# EAGLE design Prototype 0.2 (EAGLE 9.7.0)
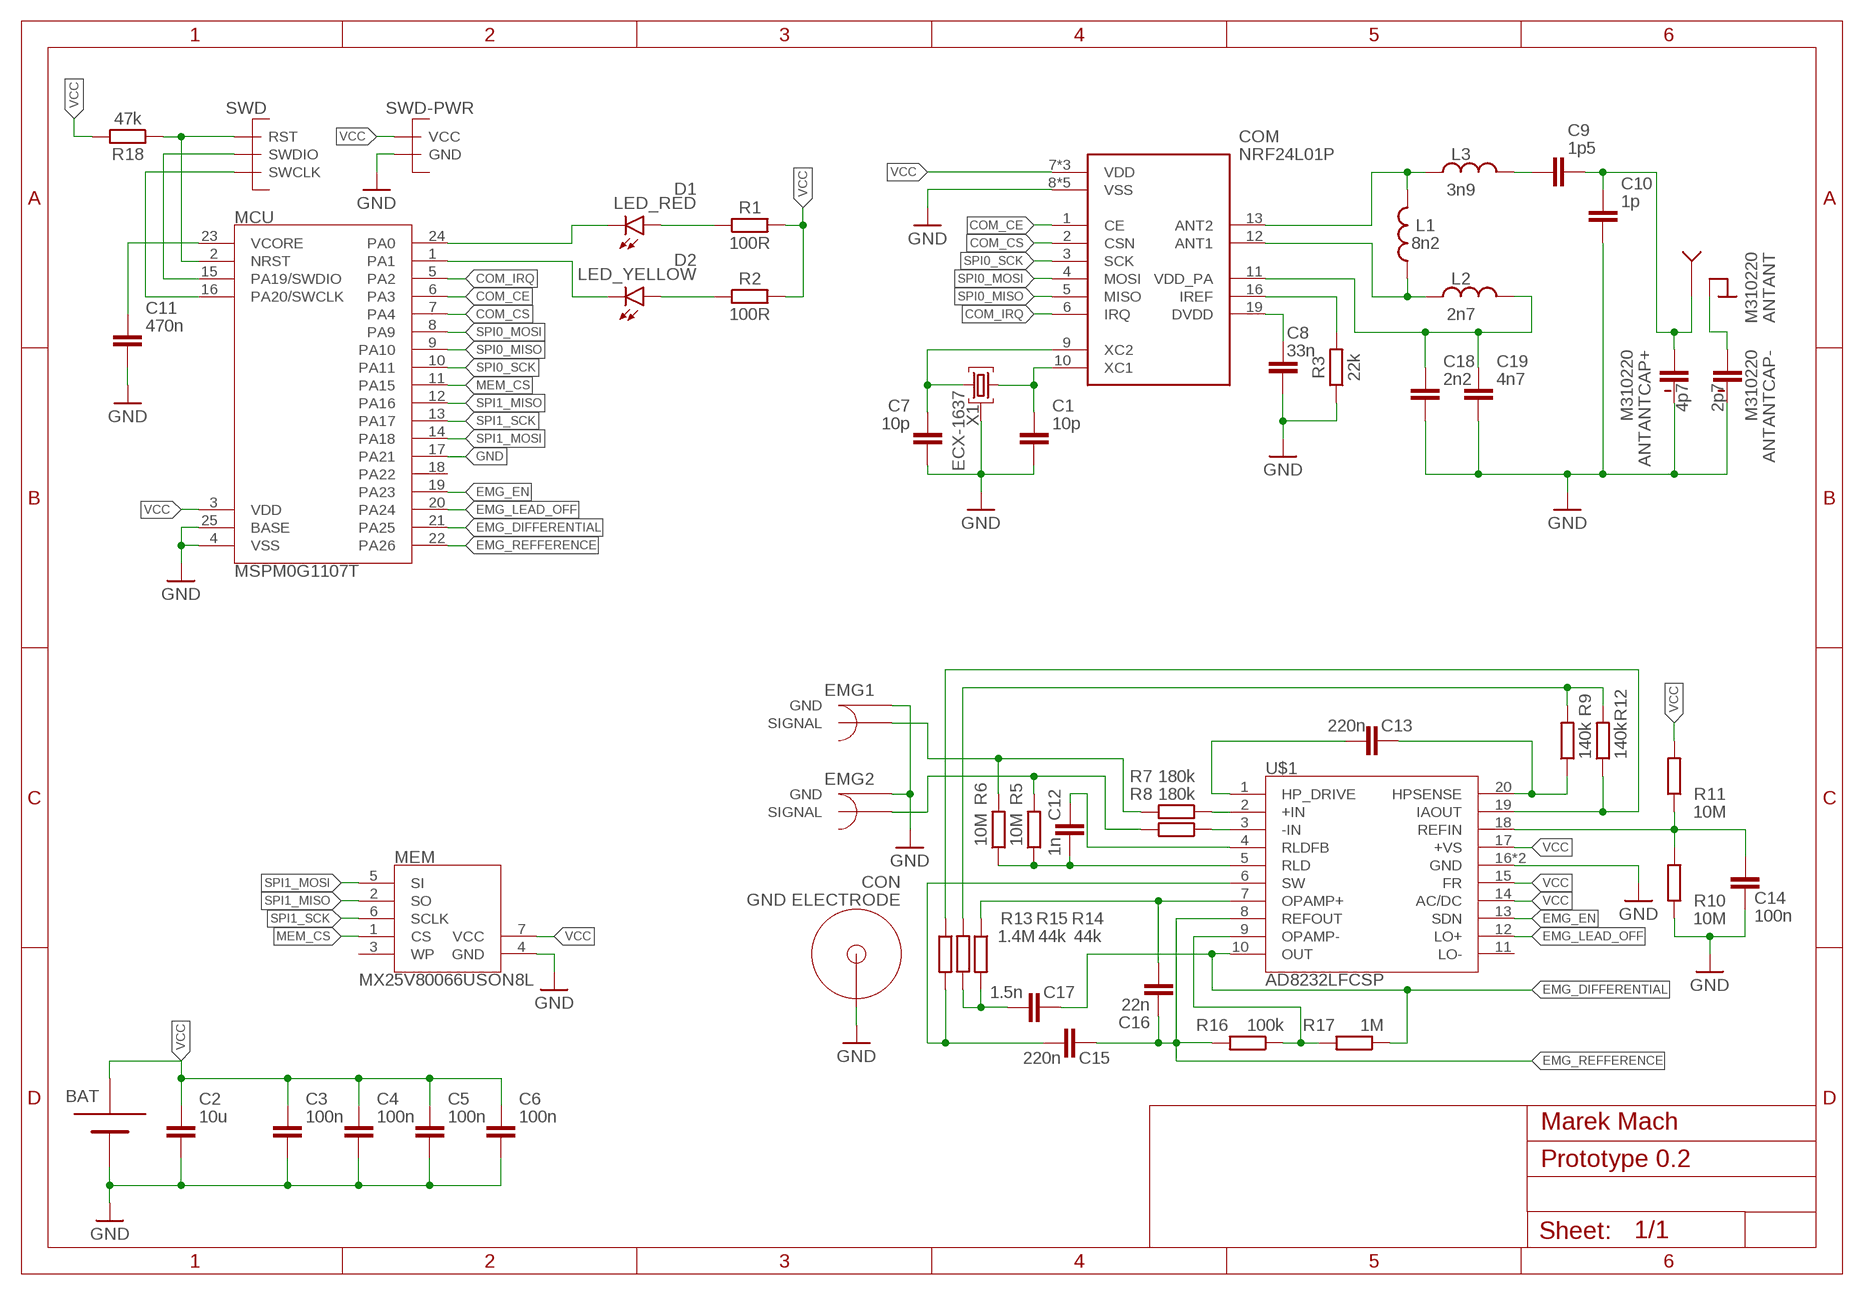
[diagram p0: schematic, sheet 1]

## Parts
ANT  M310220  [M310220]
BAT  2025BAT-HLD-005-THM  [BAT-HLD-005-THM]
C1  10p  C_CHIP-0402(1005-METRIC)  [CAPC1005X60]
C2  10u  C_CHIP-0603(1608-METRIC)  [CAPC1608X85]
C3  100n  C_CHIP-0603(1608-METRIC)  [CAPC1608X85]
C4  100n  C_CHIP-0603(1608-METRIC)  [CAPC1608X85]
C5  100n  C_CHIP-0603(1608-METRIC)  [CAPC1608X85]
C6  100n  C_CHIP-0603(1608-METRIC)  [CAPC1608X85]
C7  10p  C_CHIP-0402(1005-METRIC)  [CAPC1005X60]
C8  33n  C_CHIP-0402(1005-METRIC)  [CAPC1005X60]
C9  1p5  C_CHIP-0402(1005-METRIC)  [CAPC1005X60]
C10  1p  C_CHIP-0402(1005-METRIC)  [CAPC1005X60]
C11  470n  C_CHIP-0603(1608-METRIC)  [CAPC1608X85]
C12  1n  C_CHIP-0603(1608-METRIC)  [CAPC1608X85]
C13  220n  C_CHIP-0603(1608-METRIC)  [CAPC1608X85]
C14  100n  C_CHIP-0603(1608-METRIC)  [CAPC1608X85]
C15  220n  C_CHIP-0603(1608-METRIC)  [CAPC1608X85]
C16  22n  C_CHIP-0603(1608-METRIC)  [CAPC1608X85]
C17  1.5n  C_CHIP-0603(1608-METRIC)  [CAPC1608X85]
C18  2n2  C_CHIP-0402(1005-METRIC)  [CAPC1005X60]
C19  4n7  C_CHIP-0402(1005-METRIC)  [CAPC1005X60]
COM  NRF24L01P  NRF24L01PQFN20  [QFN50P400X400X100-21T265]
CON  GND ELECTRODE  ECG_ELECTRODE_CONNECTOR  [ELECTRODE_CONNECTOR]
D1  LED_RED  CHIP-FLAT-R_0402  [LEDC1005X25N_FLAT-R]
D2  LED_YELLOW  CHIP-FLAT-Y_0402  [LEDC1005X25N_FLAT-Y]
EMG1  SHIELDED-CONNECTOR  [SHIELDED-SMD]
EMG2  SHIELDED-CONNECTOR  [SHIELDED-SMD]
L1  8n2  L_CHIP-0402(1006-METRIC)  [INDC1006X60N]
L2  2n7  L_CHIP-0402(1006-METRIC)  [INDC1006X60N]
L3  3n9  L_CHIP-0402(1006-METRIC)  [INDC1006X60N]
MCU  MSPM0G1107T  MSPM0G1107VQFN24-ROUNDPADS  [QFN50P400X400X100-25T240]
MEM  MX25V80066USON8L  [SON50P300X200X50-8]
R1  100R  R_CHIP-0603(1608-METRIC)  [RESC1608X60]
R2  100R  R_CHIP-0603(1608-METRIC)  [RESC1608X60]
R3  22k  R_CHIP-0402(1005-METRIC)  [RESC1005X40]
R5  10M  R_CHIP-0603(1608-METRIC)  [RESC1608X60]
R6  10M  R_CHIP-0603(1608-METRIC)  [RESC1608X60]
R7  180k  R_CHIP-0603(1608-METRIC)  [RESC1608X60]
R8  180k  R_CHIP-0603(1608-METRIC)  [RESC1608X60]
R9  140k  R_CHIP-0603(1608-METRIC)  [RESC1608X60]
R10  10M  R_CHIP-0603(1608-METRIC)  [RESC1608X60]
R11  10M  R_CHIP-0603(1608-METRIC)  [RESC1608X60]
R12  140k  R_CHIP-0603(1608-METRIC)  [RESC1608X60]
R13  1.4M  R_CHIP-0603(1608-METRIC)  [RESC1608X60]
R14  44k  R_CHIP-0603(1608-METRIC)  [RESC1608X60]
R15  44k  R_CHIP-0603(1608-METRIC)  [RESC1608X60]
R16  100k  R_CHIP-0603(1608-METRIC)  [RESC1608X60]
R17  1M  R_CHIP-0603(1608-METRIC)  [RESC1608X60]
R18  47k  R_CHIP-0603(1608-METRIC)  [RESC1608X60]
SWD  SWD  [3X]
SWD-PWR  PWR  [2X]
U$1  AD8232LFCSP  [QFN50P400X400X80-21T275]
X1  ECX-1637  [WE-XTAL_IQXC-42]

## Nets
COM_CE: COM.1(CE) MCU.6(PA3)
COM_CS: COM.2(CSN) MCU.7(PA4)
COM_IRQ: COM.6(IRQ) MCU.5(PA2)
EMG_DIFFERENTIAL [Analog]: C17.2 MCU.21(PA25) R17.1 U$1.10(OUT)
EMG_EN [Data]: MCU.19(PA23) U$1.13(SDN)
EMG_LEAD_OFF [Data]: MCU.20(PA24) U$1.12(LO+)
EMG_REFFERENCE [Analog]: C15.2 C16.1 MCU.22(PA26) R16.2 U$1.8(REFOUT)
GND: ANT.FEEDCAP-GND(ANTCAP+:NEG) ANT.GNDCAP-GND(ANTCAP-:NEG) BAT.P$1(-) C1.2 C2.2 C3.2 C4.2 C5.2 C6.2 C7.2 C8.2 C10.2 C11.2 C14.1 C18.2 C19.2 COM.8(VSS) COM.14(VSS) COM.17(VSS) COM.20(VSS) COM.21(VSS) CON.P$1 CON.P$2 CON.P$3 CON.P$4 EMG1.GND1(GND) EMG1.GND2(GND) EMG2.GND1(GND) EMG2.GND2(GND) MCU.4(VSS) MCU.17(PA21) MCU.25(BASE) MEM.4(GND) R3.1 R10.1 SWD-PWR.1(GND) U$1.16(GND) U$1.21(GND) X1.2(GND) X1.4(GND)
MEM_CS [Data]: MCU.11(PA15) MEM.1(CS)
N$1: C1.1 COM.10(XC1) X1.1
N$2 [VCC]: C11.1 MCU.23(VCORE)
N$3: D1.A R1.1
N$4: D2.A R2.1
N$5: C7.1 COM.9(XC2) X1.3
N$6: ANT.GNDCAP-GROUND(ANTCAP-:POS) ANT.GROUND
N$7: C8.1 COM.19(DVDD)
N$8: COM.13(ANT2) L1.2 L3.1
N$9: C9.1 L3.2
N$10 [Analog]: EMG1.SIG(SIGNAL) R6.2 R7.2
N$11 [Analog]: EMG2.SIG(SIGNAL) R5.2 R8.2
N$12 [Analog]: R7.1 U$1.2(+IN)
N$13 [Analog]: R8.1 U$1.3(-IN)
N$14 [Analog]: C16.2 R14.1 U$1.7(OPAMP+)
N$16 [Analog]: R16.1 R17.2 U$1.9(OPAMP-)
N$17 [Analog]: R9.2 R12.2 R15.2
N$18 [Analog]: C12.1 R5.1 R6.1 U$1.5(RLD)
N$19 [Analog]: C13.1 U$1.1(HP_DRIVE)
N$20 [Analog]: C13.2 R9.1 U$1.20(HPSENSE)
N$21: COM.16(IREF) R3.2
N$22 [Analog]: C14.2 R10.2 R11.1 U$1.18(REFIN)
N$23: COM.12(ANT1) L1.1 L2.1
N$24 [Analog]: C15.1 R13.2 U$1.6(SW)
N$25: C17.1 R14.2 R15.1
N$26 [Analog]: R12.1 R13.1 U$1.19(IAOUT)
N$27 [Analog]: C12.2 U$1.4(RLDFB)
N$28: ANT.FEED(ANT:ANTENNA) ANT.FEEDCAP-ANT(ANTCAP+:POS) C9.2 C10.1
N$29: C18.1 C19.1 COM.11(VDD_PA) L2.2
RED-STATUS-LED [Data]: D1.C MCU.24(PA0)
RST [Data]: MCU.2(NRST) R18.1 SWD.1(RST)
SPI0_MISO: COM.5(MISO) MCU.9(PA10)
SPI0_MOSI: COM.4(MOSI) MCU.8(PA9)
SPI0_SCK: COM.3(SCK) MCU.10(PA11)
SPI1_MISO [Data]: MCU.12(PA16) MEM.2(SO)
SPI1_MOSI [Data]: MCU.14(PA18) MEM.5(SI)
SPI1_SCK [Data]: MCU.13(PA17) MEM.6(SCLK)
SWCLK [Data]: MCU.16(PA20/SWCLK) SWD.3(SWCLK)
SWDIO [Data]: MCU.15(PA19/SWDIO) SWD.2(SWDIO)
VCC [VCC]: BAT.P$2(+) BAT.P$3(+) C2.1 C3.1 C4.1 C5.1 C6.1 COM.7(VDD) COM.15(VDD) COM.18(VDD) MCU.3(VDD) MEM.7(VCC) R1.2 R2.2 R11.2 R18.2 SWD-PWR.2(VCC) U$1.14(AC/DC) U$1.15(FR) U$1.17(+VS)
YELLOW-STATUS-LED [Data]: D2.C MCU.1(PA1)
Unconnected: MCU.18(PA22) MEM.3(WP) U$1.11(LO-)

## Notes on the sheet
- 4p7 | 2p7
- Marek Mach

## Library data of the parts
ANT = Antenna:M310220
BAT = batery holder:2025: Coin Cell Battery Holders THM COIN CELL CLIP FOR (2) 2032 Source: Datasheet <https://www.keyelco.com/product-pdf.cfm?p=740>
C1 C7-C10 C18 C19 = Capacitor:C: Capacitor - Generic; CATEGORY: Capacitor; PACKAGE_SIZE: 0402; PACKAGE_TYPE: SMD; SUBCATEGORY: Ceramic Capacitors; TYPE: MLCC
C2-C6 C11-C17 = Capacitor:C: Capacitor - Generic; CATEGORY: Capacitor; PACKAGE_SIZE: 0603; PACKAGE_TYPE: SMD; SUBCATEGORY: Ceramic Capacitors; TYPE: MLCC
COM = nRF24L01:NRF24L01P: Single Chip 2.4GHz Transceiver Source: Datasheet
CON = Ecg Electrodes:ECG_ELECTRODE_CONNECTOR
D1 = LED:CHIP-FLAT-R; CATEGORY: LED; COLOR: RED; DESCRIPTION: CHIP LED FLAT; SUB-CATEGORY: CHIP; TYPE: FLAT_TOP
D2 = LED:CHIP-FLAT-Y; CATEGORY: LED; COLOR: YELLOW; DESCRIPTION: CHIP LED FLAT; SUB-CATEGORY: CHIP; TYPE: FLAT_TOP
EMG1 EMG2 = Ecg Electrodes:SHIELDED-CONNECTOR
L1-L3 = Inductor:L: Inductor Fixed - Generic; CATEGORY: Inductor; SUB-CATEGORY: Fixed
MCU = Texas Instruments:MSPM0G1107
MEM = MemoryChips:MX25V80066
R1-R3 R5-R18 = Resistor:R: Resistor Fixed - Generic; CATEGORY: Resistor; SUB-CATEGORY: Fixed
SWD = DebugConnectors§:SWD
SWD-PWR = DebugConnectors§:PWR
U$1 = Ecg Electrodes:AD8232
X1 = Crystals:ECX-1637

## Board
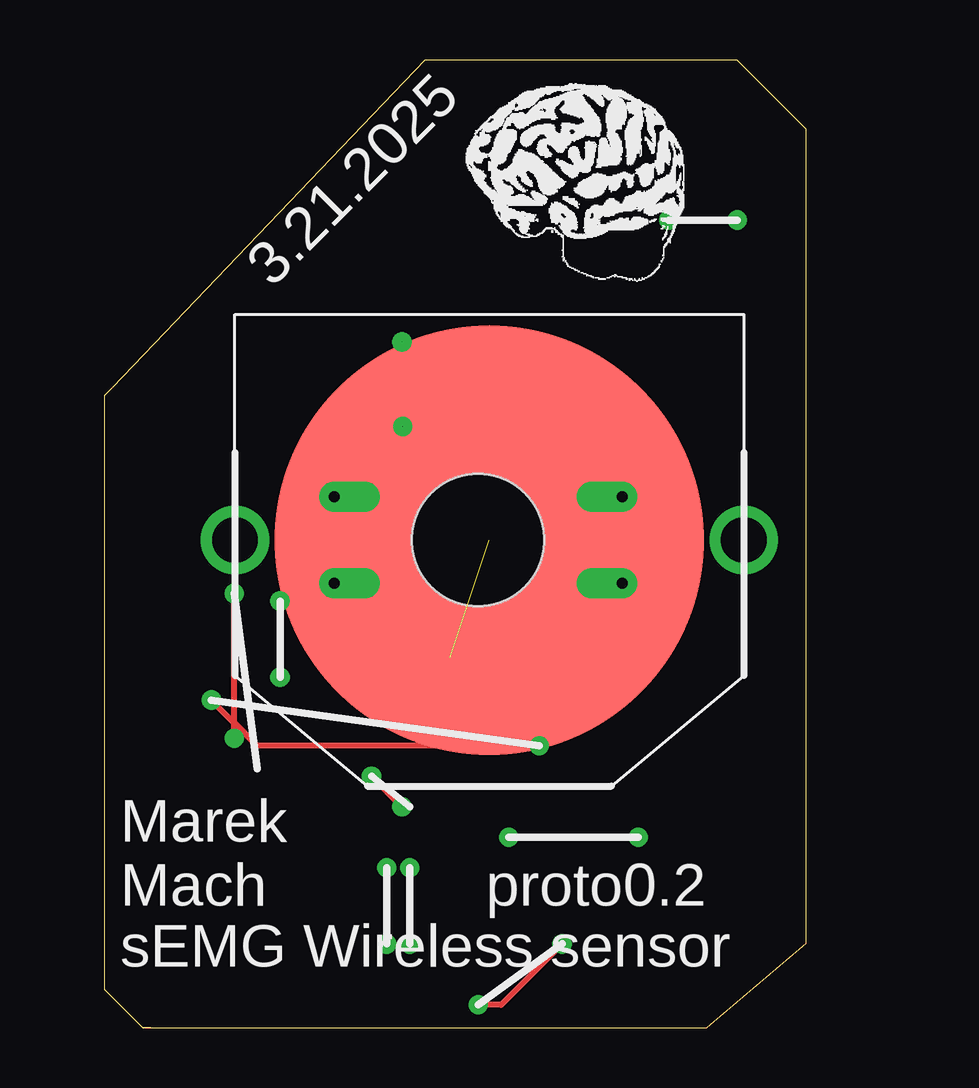
[diagram p1: board, top side]
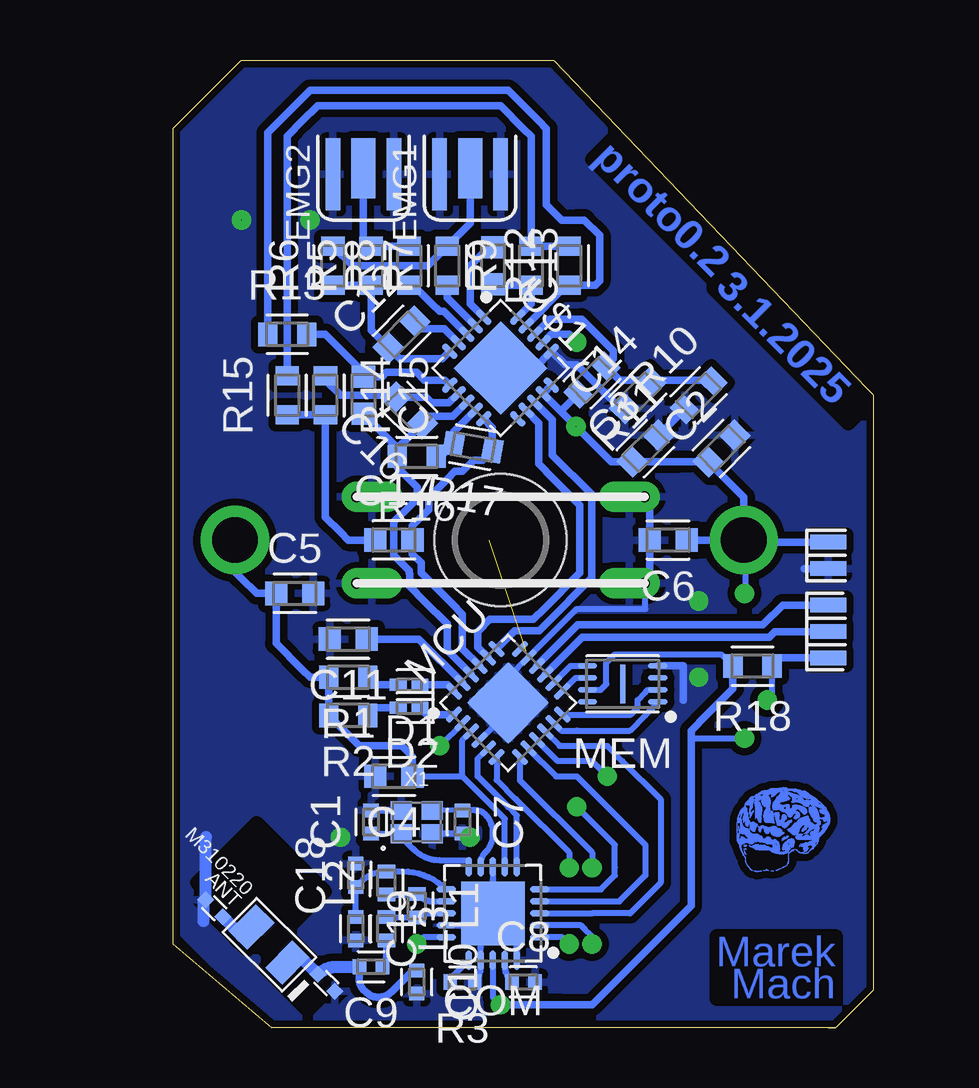
[diagram p2: board, bottom side, seen from below]

Size 29.21 x 40.32 mm. Coordinates in mm from the lower left corner, seen from the top.
Outline: 1.59,0 25.08,0 29.21,3.49 29.21,37.47 26.35,40.32 13.34,40.32 0.32,26.67 0,26.35 0,1.59 1.59,0
Outline: 1.59,0 1.9,0 1.59,0
Copper layers (1*16): Top 0.035mm / dielectric 1.5mm / Bottom 0.035mm
Design rules "Fusion Electronics Design Rules *": minimum track width 6mil, minimum drill 0.35mm, track to track 6mil, track to pad 6mil, pad to pad 6mil, via to via 6mil, smd to smd 6mil, copper to edge 12mil, drill to drill 6mil, minimum pad ring 10mil, minimum via ring 8mil, stop-mask expansion 4mil, vias tented up to drill 0mil, thermal gap 10mil

### Footprints (pad centres in the part's own frame; a part is rotated, then mirrored left to right if it is on the bottom)
M310220 = smd 1 x 1.6: FEED -1,-0.8 | smd 0.5 x 0.5: FEEDCAP-ANT -2.25,-1.35; FEEDCAP-GND -3.25,-1.35; GNDCAP-GND 3.25,-0.25; GNDCAP-GROUND 2.25,-0.25 | smd 1.1 x 1.6: GROUND 1.1,-0.8
BAT-HLD-005-THM = smd 17.9 x 17.9: P$1 0,0 | drill 1.9 pad 2.6: P$2 -10.6,0; P$3 10.6,0
CAPC1005X60 = smd 0.56 x 0.629: 1 -0.485,0; 2 0.485,0
CAPC1608X85 = smd 0.921 x 0.97: 1 -0.775,0; 2 0.775,0
QFN50P400X400X100-21T265 = smd 0.811 x 0.264: 1 -1.951,1; 2 -1.951,0.5; 3 -1.951,0; 4 -1.951,-0.5; 5 -1.951,-1; 11 1.951,-1; 12 1.951,-0.5; 13 1.951,0; 14 1.951,0.5; 15 1.951,1 | smd 0.264 x 0.811: 6 -1,-1.951; 7 -0.5,-1.951; 8 0,-1.951; 9 0.5,-1.951; 10 1,-1.951; 16 1,1.951; 17 0.5,1.951; 18 0,1.951; 19 -0.5,1.951; 20 -1,1.951 | smd 2.65 x 2.65: 21 0,0
ELECTRODE_CONNECTOR = drill 0.45 pad 1.27 offset: P$1 -6,1.8; P$2 -6,-1.8; P$3 6,-1.8; P$4 6,1.8 | hole 5.5: 0,0
LEDC1005X25N_FLAT-R = smd 0.7 x 0.5: A 0.45,0; C -0.45,0
LEDC1005X25N_FLAT-Y = smd 0.7 x 0.5: A 0.45,0; C -0.45,0
SHIELDED-SMD = smd 3 x 0.6: GND1 0,1.27; GND2 0,-1.27 | smd 2.5 x 1: SIG 0.25,0
INDC1006X60N = smd 0.56 x 0.729: 1 -0.485,0; 2 0.485,0
QFN50P400X400X100-25T240 = smd 0.837 x 0.27: 1 -1.937,1.25; 2 -1.937,0.75; 3 -1.937,0.25; 4 -1.937,-0.25; 5 -1.937,-0.75; 6 -1.937,-1.25; 13 1.937,-1.25; 14 1.937,-0.75; 15 1.937,-0.25; 16 1.937,0.25; 17 1.937,0.75; 18 1.937,1.25 | smd 0.27 x 0.837: 7 -1.25,-1.937; 8 -0.75,-1.937; 9 -0.25,-1.937; 10 0.25,-1.937; 11 0.75,-1.937; 12 1.25,-1.937; 19 1.25,1.937; 20 0.75,1.937; 21 0.25,1.937; 22 -0.25,1.937; 23 -0.75,1.937; 24 -1.25,1.937 | smd 2.4 x 2.4: 25 0,0
SON50P300X200X50-8 = smd 0.787 x 0.22: 1 -1.462,0.75; 2 -1.462,0.25; 3 -1.462,-0.25; 4 -1.462,-0.75; 5 1.462,-0.75; 6 1.462,-0.25; 7 1.462,0.25; 8 1.462,0.75 | smd 0.2 x 1.6: 9 0,0
RESC1608X60 = smd 0.799 x 0.974: 1 -0.815,0; 2 0.815,0
RESC1005X40 = smd 0.535 x 0.644: 1 -0.507,0; 2 0.507,0
3X = smd 1.5 x 0.6: 1 0,1.1; 2 0,0; 3 0,-1.1
2X = smd 1.5 x 0.6: 1 0,0.55; 2 0,-0.55
QFN50P400X400X80-21T275 = smd 0.8 x 0.3: 1 -2,1; 2 -2,0.5; 3 -2,0; 4 -2,-0.5; 5 -2,-1; 11 2,-1; 12 2,-0.5; 13 2,0; 14 2,0.5; 15 2,1 | smd 0.3 x 0.8: 6 -1,-2; 7 -0.5,-2; 8 0,-2; 9 0.5,-2; 10 1,-2; 16 1,2; 17 0.5,2; 18 0,2; 19 -0.5,2; 20 -1,2 | smd 2.75 x 2.75: 21 0,0
WE-XTAL_IQXC-42 = smd 0.875 x 0.775: 1 -0.637,-0.487; 2 0.637,-0.487; 3 0.637,0.487; 4 -0.637,0.487

### Placement (x,y rotation side)
ANT  25.72,2.86 135 bottom
BAT  16.02,20.32 0 top
C1  20.95,8.57 90 bottom
C2  6.35,24.13 45 bottom
C3  9.53,24.13 45 bottom
C4  20,10.48 180 bottom
C5  24.13,18.1 0 bottom
C6  8.57,20.32 180 bottom
C7  17.14,8.57 270 bottom
C8  14.61,1.91 0 bottom
C9  20.95,2.54 180 bottom
C10  19.05,1.91 270 bottom
C11  21.91,16.19 180 bottom
C12  19.68,28.89 45 bottom
C13  15.88,31.75 270 bottom
C14  9.84,26.35 45 bottom
C15  21.27,26.35 270 bottom
C16  19.38,25.72 135 bottom
C17  20,20.32 0 bottom
C18  21.59,6.35 90 bottom
C19  21.59,4.13 270 bottom
COM  15.88,4.76 180 bottom
CON  15.56,20.32 0 bottom
D1  19.37,14.29 180 bottom
D2  19.37,13.34 180 bottom
EMG1  16.83,35.56 90 bottom
EMG2  21.27,35.56 90 bottom
L1  19.05,5.08 270 bottom
L2  20.32,6.03 90 bottom
L3  20.32,4.13 270 bottom
MCU  15.24,13.53 45 bottom
MEM  10.47,14.32 180 bottom
R1  21.91,14.61 180 bottom
R2  21.91,13.02 180 bottom
R3  17.14,1.91 180 bottom
R5  20.95,31.75 90 bottom
R6  22.54,31.75 90 bottom
R7  17.78,31.75 90 bottom
R8  19.37,31.75 90 bottom
R9  14.29,31.75 90 bottom
R10  7.3,26.35 45 bottom
R11  11.75,26.99 225 bottom
R12  12.7,31.75 90 bottom
R13  24.45,28.89 0 bottom
R14  22.86,26.35 270 bottom
R15  24.45,26.35 90 bottom
R16  19.05,23.81 180 bottom
R17  16.7,24.19 170 bottom
R18  5.06,15.07 180 bottom
SWD  1.9,16.51 180 bottom
SWD-PWR  1.9,19.69 180 bottom
U$1  15.56,27.49 315 bottom
X1  19.05,8.57 0 bottom

### Tracks (layer width: path | path; a pad name or v marks a point on that pad's centre or on a via)
COM_CE  (via drill 0 pad 0.8)
  Top 0.254: v12.7,6.67 v12.7,3.49
  Bottom 0.254: MCU.6 15.73,10.33 14.92,9.53 12.7,7.3 v12.7,6.67 | v12.7,3.49 12.97,3.76 COM.1
COM_CS  (via drill 0 pad 0.8)
  Top 0.254: v11.75,6.67 v11.75,3.49
  Bottom 0.254: MCU.7 14.75,10.31 11.75,7.3 v11.75,6.67 | v11.75,3.49 11.75,3.81 12.07,4.13 12.2,4.26 COM.2
COM_IRQ
  Bottom 0.254: COM.6 14.87,8.84 15.24,9.21 16.51,10.48 16.51,11.11 16.51,11.2 MCU.5
EMG_DIFFERENTIAL
  Bottom 0.305: MCU.21 17.15,15.79 17.15,16.83 17.15,17.23 17.58,17.66 18.87,18.95 18.87,19.37 19.23,19.73 C17.2 19.23,20.91 18.55,21.59 18.55,22.09 17.78,22.86 17.46,23.18 17.15,23.18 16.67,23.65 16.3,23.65 R17.1 15.9,25 U$1.10
EMG_EN
  Bottom 0.305: MCU.19 14.96,16.55 13.94,16.55 13.66,16.83 11.79,18.7 | U$1.13 13.4,25.33 13.4,23.86 11.77,22.23 11.77,18.72 | 11.79,18.7 11.77,18.72 | 11.79,18.7 11.77,18.72
EMG_LEAD_OFF
  Bottom 0.305: 12.25,18.95 12.25,21.59 12.25,21.77 13.34,22.86 13.97,23.5 13.97,24.13 13.97,25.19 U$1.12 | MCU.20 16.51,15.86 16.51,16.51 16.01,17.01 15.24,17.01 14.19,17.01 13.74,17.46 | 13.74,17.46 12.25,18.95 | 13.74,17.46 12.25,18.95
EMG_REFFERENCE
  Bottom 0.305: MCU.22 17.78,15.72 17.78,16.19 17.78,16.83 18.73,17.78 19.35,18.39 19.35,18.91 19.37,18.93 19.37,19.05 20,19.69 20,20.95 20,21.08 19.37,21.71 19.03,22.05 19.03,22.52 19.37,22.86 19.87,23.36 R16.2 | U$1.8 17.56,25.49 18.51,25.49 C16.1 19.35,24.65 19.87,24.14 R16.2 | C15.2 19.87,24.17 R16.2
GND  (via drill 0 pad 0.8)  (1 unrouted)
  Top 0.254: v7.3,14.61 v7.3,17.78
  Top 0.305: v26.35,33.66 v23.49,33.66 | v16.83,7.94 v22.22,7.94
  Bottom 0.254: C1.2 X1.4 arc-45 X1.4 | COM.8 15.87,5.71 COM.21 | COM.14 17.08,4.26 arc-45 COM.21 | COM.21 arc-45 16.38,3.56 COM.17 16.38,2.54 arc45 R3.1 | COM.20 14.87,3.76 COM.21 | X1.2 C7.2 16.98,8.09 v16.83,7.94 | CON.P$3 9.52,18.49 9.52,17.45 12.38,17.45 MCU.17 15.24,14.59 MCU.25 15.24,13.18 MCU.4
  Bottom 0.305: 10.39,26.27 C14.1 10.56,25.8 12.38,27.62 12.86,27.62 U$1.16 14.14,27.49 U$1.21 | 7.94,13.65 7.94,15.07 MEM.4 | 2.91,19.13 SWD-PWR.1 | C3.2 R10.1 | CON.P$3 9.35,18.73 C6.2 9.35,21.91 CON.P$4
  Bottom 0.508: 27.84,7.94 ANT.GNDCAP-GND 27.94,5.23 27.94,4.45
  pour Bottom (isolate 0.305): 1.65,0.15 25.02,0.15 29.06,4.19 29.06,38.04 26.61,40.49 13.72,40.49 0.15,26.92 0.15,1.65
MEM_CS
  Bottom 0.254: MCU.11 13.03,12.38 12.38,12.38 10.16,12.38 9.52,13.02 9.01,13.54 MEM.1
N$1
  Bottom 0.203: X1.1 C1.1 | 16.88,6.99 COM.10
  Bottom 0.254: X1.1 arc-45 19.58,7.84 19.21,7.46 19.18,7.43 arc-45 18.1,6.99 16.88,6.99
  Bottom 0.305: C1.1
N$2
  Bottom 0.305: C11.1 18.96,16.19 MCU.23
N$3
  Bottom 0.305: R1.1 20.77,14.29 D1.A
N$4
  Bottom 0.305: R2.1 20.77,13.34 D2.A
N$5
  Bottom 0.203: C7.1 X1.3
  Bottom 0.254: COM.9 16.38,6.86 arc45 16.19,7.3 arc-45 15.87,8.07 15.87,8.12 arc-45 16.19,8.89 arc-45 16.6,9.06 C7.1
  Bottom 0.305: X1.3
N$6
  Bottom 0.508: ANT.GNDCAP-GROUND 26.35,3.85 26.35,3.81 26.32,3.81 ANT.GROUND
N$7
  Bottom 0.254: C8.1 arc45 15.37,2.59 COM.19
N$8
  Bottom 0.254: COM.13 18.65,4.76 arc-45 L1.2 arc-45 19.09,4.61 L3.1
N$9
  Bottom 0.254: C9.1 20.32,2.69 L3.2
N$10
  Bottom 0.305: R6.2 21.73,31.75 21.59,31.75 18.6,31.75 R7.2 16.83,33.52 16.83,35.56 | EMG1.SIG 16.83,35.56 | 16.83,35.56 16.83,35.24
N$11
  Bottom 0.305: R8.2 R5.2 21.27,32.88 21.27,35.56 EMG2.SIG
N$12
  Bottom 0.305: U$1.2 17.78,30.42 R7.1
N$13
  Bottom 0.305: U$1.3 17.92,29.84 18.1,29.84 18.42,30.16 19.19,30.94 R8.1
N$14
  Bottom 0.305: U$1.7 17.72,26.04 18.42,26.04 18.65,26.27 C16.2 20.01,26.35 22.22,26.35 22.86,26.99 R14.1
N$16
  Bottom 0.305: 18.03,23.81 R16.1 18.03,23.81 | U$1.9 17.5,24.83 R17.2 18.03,23.81
N$17
  Bottom 0.305: R12.2 R9.2 14.29,37.15 14.6,37.47 15.56,38.42 19.05,38.42 23.18,38.42 23.81,37.78 24.45,37.15 R15.2
N$18
  Bottom 0.305: U$1.5 18,27.88 19.76,27.88 C12.1 20.95,29.07 R5.1 R6.1
N$19
  Bottom 0.305: U$1.1 16.83,30.17 16.83,31.75 16.05,32.52 C13.1
N$20
  Bottom 0.305: U$1.20 14.29,30.17 R9.1 15.83,30.94 C13.2
N$21
  Bottom 0.254: R3.2 arc45 17.56,2.13 COM.16
N$22
  Bottom 0.305: U$1.18 13.52,29.53 12.18,29.53 10.85,28.2 10.85,27.88 R11.1 10.59,26.99 10.16,26.99 9.38,26.99 C14.2 9.21,26.99 6.78,26.99 R10.2
N$23
  Bottom 0.254: COM.12 18.32,5.26 arc45 L1.1 arc45 19.09,5.55 L2.1
N$24
  Bottom 0.305: U$1.6 17.89,26.99 18.42,26.99 18.73,26.99 19.05,27.3 19.37,27.3 20.32,27.3 20.5,27.13 C15.1 21.27,27.3 21.91,27.94 22.86,28.89 R13.2
N$25
  Bottom 0.305: C17.1 21.91,20.32 22.22,20.64 22.86,21.27 R14.2 R15.1
N$26
  Bottom 0.305: U$1.19 12.82,30.94 R12.1 11.61,30.94 11.43,31.12 11.43,33.02 12.07,33.66 12.38,33.66 13.02,33.66 13.65,34.29 13.65,36.2 13.65,37.47 13.97,37.78 15.24,39.05 23.49,39.05 24.45,38.1 25.26,37.29 R13.1
N$27
  Bottom 0.305: C12.2 18.82,29.12 17.9,29.12 U$1.4
N$28
  Bottom 0.305: C9.2 21.44,1.99 arc-45 21.27,1.59 21.18,1.5 arc-45 20.64,1.27 arc-45 20.1,1.5 20,1.59 19.31,2.28 arc45 C10.1
  Bottom 0.508: ANT.FEED 24.3,2.86 23.81,2.86 ANT.FEEDCAP-ANT arc45 22.4,2.54 C9.2
N$29
  Bottom 0.254: C19.1 C18.1 21.38,6.08 arc45 L2.2 19.63,6.52 arc45 COM.11
RED-STATUS-LED
  Bottom 0.305: D1.C 17.76,14.29 MCU.24
RST  (via drill 0 pad 0.8)
  Top 0.254: v18.1,11.75 6.35,11.75 v4.45,13.65
  Bottom 0.254: MCU.2 18.09,11.75 v18.1,11.75 | v4.45,13.65 4.25,13.85 4.25,14.98
  Bottom 0.305: 4.25,14.98 R18.1 3.9,15.41 SWD.1
SPI0_MISO  (via drill 0 pad 0.8)
  Top 0.254: v12.38,9.21 v11.11,10.48
  Bottom 0.254: COM.5 11.38,5.76 10.79,6.35 10.79,6.67 10.79,7.62 v12.38,9.21 | v11.11,10.48 11.75,11.11 12.38,11.11 13.17,11.11 MCU.9
SPI0_MOSI
  Bottom 0.254: COM.4 10.61,5.26 9.52,6.35 9.52,7.62 12.38,10.48 13.25,10.48 MCU.8
SPI0_SCK
  Bottom 0.254: COM.3 11.75,4.76 10.16,4.76 8.89,6.03 8.89,9.53 10.48,11.11 11.11,11.75 11.43,11.75 13.1,11.75 MCU.10
SPI1_MISO
  Bottom 0.254: MCU.12 10.13,13.05 9.84,13.34 9.84,13.65 9.52,13.97 9.42,14.07 MEM.2
SPI1_MOSI
  Bottom 0.254: MCU.14 12.64,15.07 MEM.5
SPI1_SCK
  Bottom 0.254: MCU.13 12.43,14.57 MEM.6
SWCLK
  Bottom 0.305: MCU.16 12.34,16.79 4.63,16.79 3.81,17.61 SWD.3
SWDIO
  Bottom 0.305: MCU.15 12.15,16.27 4.36,16.27 4.13,16.51 SWD.2
VCC  (via drill 0 pad 0.8)
  Top 0.254: v19.05,3.49 16.51,0.95 v15.56,0.95 | v5.4,12.07 v5.4,18.1
  Top 0.305: v12.38,28.58 12.41,28.54 v12.41,25.05
  Bottom 0.254: COM.7 15.37,8.71 16.51,9.84 17.15,10.48 | COM.18 15.87,1.27 v15.56,0.95 | COM.15 18.78,3.76 v19.05,3.49 | MEM.7 11.39,14.07 11.14,14.32 11.14,15.21 10.79,15.56 7.3,15.56 6.37,15.56 6.03,15.23 R18.2 | C4.1 17.15,10.48 | 17.15,10.48 17.15,11.98 MCU.3 | 7.62,12.07 v5.4,12.07 | v5.4,18.1 5.34,18.16 5.34,20.23
  Bottom 0.305: U$1.15 U$1.14 13.05,25.69 | 13.05,25.69 R11.2 | U$1.17 13.44,28.89 13.02,28.89 12.7,28.89 v12.38,28.58 | 13.05,25.69 v12.41,25.05 10.95,23.58 C3.1 8.17,23.58 C2.1 5.42,22.11 BAT.P$2 | 5.42,20.98 BAT.P$2 | BAT.P$3 26.62,19 26.35,18.73 25.72,18.1 C5.1 24.9,16.02 23.81,14.92 23.49,14.61 R1.2 R2.2 21.45,11.75 20.95,11.75 19.68,11.75 19.37,11.43 19.23,11.29 C4.1 | BAT.P$2 C6.1 | BAT.P$2 5.34,20.23 SWD-PWR.2 | 7.62,10.79 7.62,5.08 11.75,0.95 13.02,0.95 v15.56,0.95 | 7.62,10.79 7.62,12.07 | 7.62,10.79 7.62,11.11 7.62,12.38 6.99,13.02 6.67,13.34 5.88,14.13 R18.2
YELLOW-STATUS-LED
  Bottom 0.305: D2.C 18.63,13.05 MCU.1
(copper drawn outside any net)
  shapes: Bottom area x1331

### Text on the board
Bottom: proto0.2 | 3.1.2025 | Marek / Mach
tPlace: 3.21.2025 | Marek / Mach | proto0.2 | sEMG Wireless sensor